# Altium schematic sheet 10 - Expansion Connectors.SchDoc
size B; CompanyName: Microchip Technology Inc.; Organization: Microchip Technology; Address1: 2355 West Chandler Blvd.; Address2: Chandler, AZ  85224; Address4: USA; SheetNumber: 11; SheetTotal: 15; SheetTitle: Expansion Connectors; Time: Time
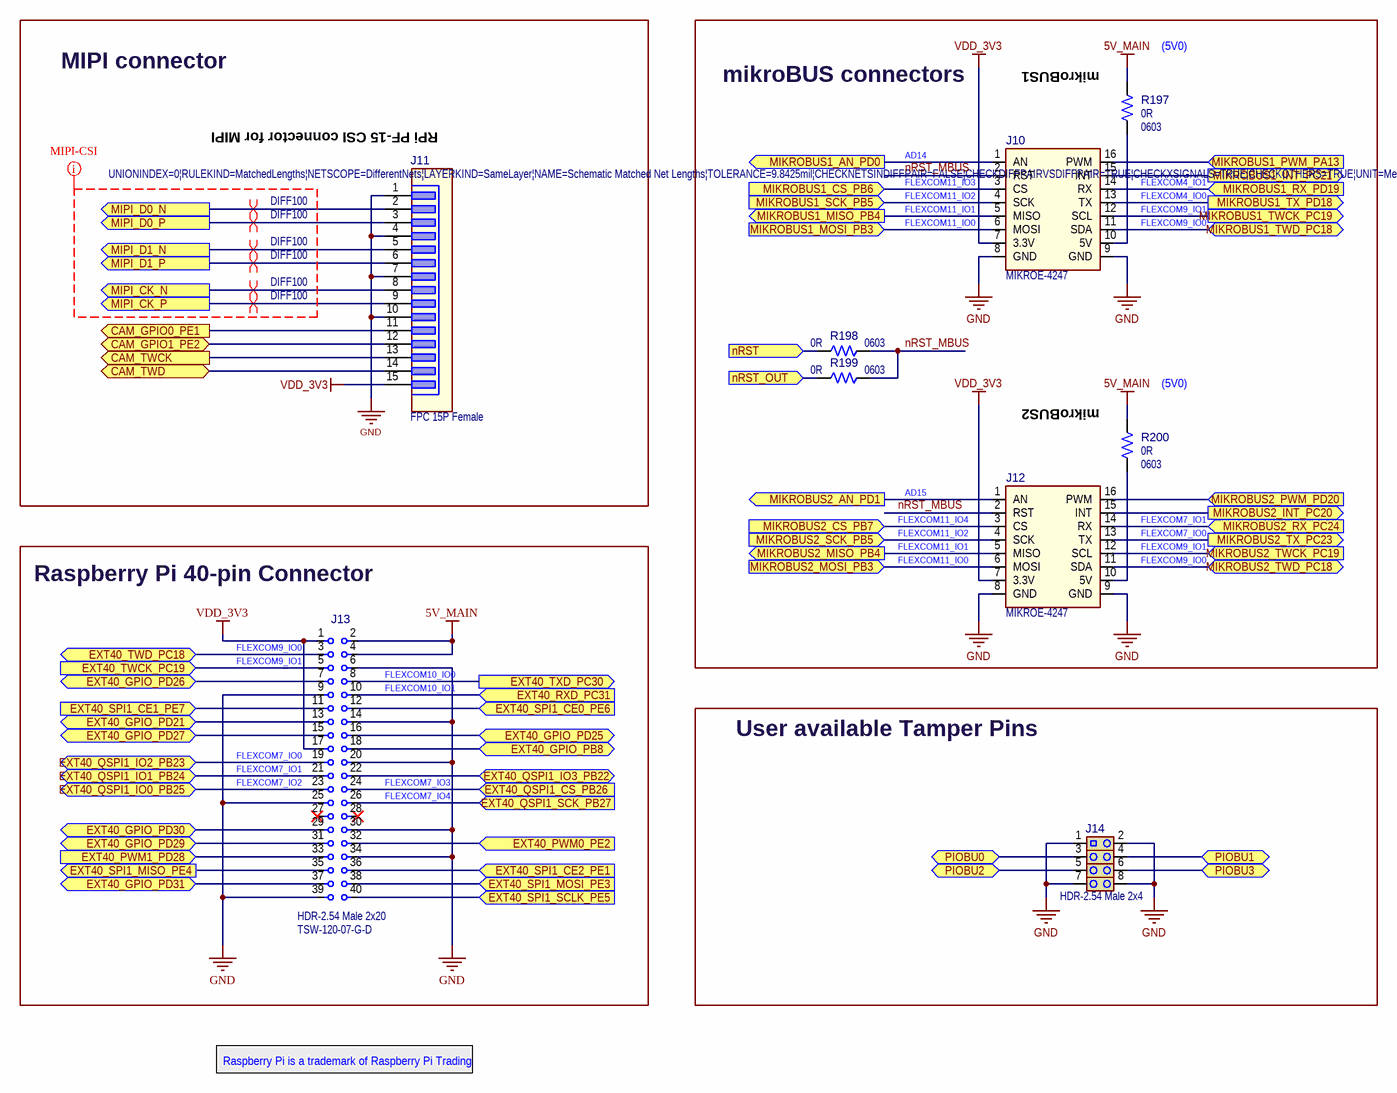
[diagram p0: 10 - Expansion Connectors.SchDoc]

## Parts
?  (no value)  (graphical)
J10  value MIKROE-4247  [SOCKET_mikroBUS_F_2.54_2x8_V_25.4x21_original]  (hidden comment: SOCKET mikroBUS HOST)
J11  value FPC 15P Female  [CON_FPC_1_FEMALE_1X15_SMD_TE_1-1734248-5]  (hidden comment: CON FPC 15pos)
J12  value MIKROE-4247  [SOCKET_mikroBUS_F_2.54_2x8_V_25.4x21_original]  (hidden comment: SOCKET mikroBUS HOST)
J13  value HDR-2.54 Male 2x20  Manufacturer Part Number 1: TSW-120-07-G-D  [HDR_M_2.54_2x20]  (hidden comment: Header 2x20)
J14  value HDR-2.54 Male 2x4  [HDR_M_2.54_2x4_SMD]  (hidden comment: Header 2x4)
R197  value 0R  Package: 0603  [RES_C_0603]  (hidden comment: Resistor)
R198  value 0R  Package: 0603  [RES_C_0603]  (hidden comment: Resistor)
R199  value 0R  Package: 0603  [RES_C_0603]  (hidden comment: Resistor)
R200  value 0R  Package: 0603  [RES_C_0603]  (hidden comment: Resistor)

## Blocks framed on the sheet
MIPI connector: J11
mikroBUS connectors: J10 J12 R197-R200
Raspberry Pi 40-pin Connector: J13
User available Tamper Pins: J14

## Ports
CAM_GPIO0_PE1 (out), CAM_GPIO1_PE2 (bidir), CAM_TWCK (out), CAM_TWD (bidir), EXT40_GPIO_PB8 (bidir), EXT40_GPIO_PD21 (bidir), EXT40_GPIO_PD25 (bidir), EXT40_GPIO_PD26 (bidir), EXT40_GPIO_PD27 (bidir), EXT40_GPIO_PD29 (bidir), EXT40_GPIO_PD30 (bidir), EXT40_GPIO_PD31 (bidir), EXT40_PWM0_PE2 (in), EXT40_PWM1_PD28 (in), EXT40_QSPI1_CS_PB26 (in), EXT40_QSPI1_IO0_PB25 (bidir), EXT40_QSPI1_IO1_PB24 (bidir), EXT40_QSPI1_IO2_PB23 (bidir), EXT40_QSPI1_IO3_PB22 (bidir), EXT40_QSPI1_SCK_PB27 (in), EXT40_RXD_PC31 (in), EXT40_SPI1_CE0_PE6 (in), EXT40_SPI1_CE1_PE7 (in), EXT40_SPI1_CE2_PE1 (in), EXT40_SPI1_MISO_PE4 (out), EXT40_SPI1_MOSI_PE3 (in), EXT40_SPI1_SCLK_PE5 (in), EXT40_TWCK_PC19 (in), EXT40_TWD_PC18 (bidir), EXT40_TXD_PC30 (out), MIKROBUS1_AN_PD0 (out), MIKROBUS1_CS_PB6 (in), MIKROBUS1_INT_PC21 (out), MIKROBUS1_MISO_PB4 (out), MIKROBUS1_MOSI_PB3 (in), MIKROBUS1_PWM_PA13 (in), MIKROBUS1_RX_PD19 (in), MIKROBUS1_SCK_PB5 (in), MIKROBUS1_TWCK_PC19 (out), MIKROBUS1_TWD_PC18 (bidir), MIKROBUS1_TX_PD18 (out), MIKROBUS2_AN_PD1 (out), MIKROBUS2_CS_PB7 (in), MIKROBUS2_INT_PC20 (out), MIKROBUS2_MISO_PB4 (out), MIKROBUS2_MOSI_PB3 (in), MIKROBUS2_PWM_PD20 (in), MIKROBUS2_RX_PC24 (in), MIKROBUS2_SCK_PB5 (in), MIKROBUS2_TWCK_PC19 (in), MIKROBUS2_TWD_PC18 (bidir), MIKROBUS2_TX_PC23 (out), MIPI_CK_N (out), MIPI_CK_P (out), MIPI_D0_N (out), MIPI_D0_P (out), MIPI_D1_N (out), MIPI_D1_P (out), nRST (in), nRST_OUT (in), PIOBU0 (bidir), PIOBU1 (bidir), PIOBU2 (bidir), PIOBU3 (bidir)

## Nets
5V_MAIN: J13.2 J13.4 R197.1 R200.1
GND: J10.8(GND) J10.9(GND) J11.1 J11.4 J11.7 J11.10 J12.8(GND) J12.9(GND) J13.6 J13.9 J13.14 J13.20 J13.25 J13.30 J13.34 J13.39 J14.1 J14.2 J14.7 J14.8
VDD_3V3: J10.7(3.3V) J11.15 J12.7(3.3V) J13.1 J13.17
CAM_GPIO0_PE1: J11.11 ; port CAM_GPIO0_PE1
CAM_GPIO1_PE2: J11.12 ; port CAM_GPIO1_PE2
CAM_TWCK: J11.13 ; port CAM_TWCK
CAM_TWD: J11.14 ; port CAM_TWD
EXT40_GPIO_PB8: J13.18 ; port EXT40_GPIO_PB8
EXT40_GPIO_PD21: J13.13 ; port EXT40_GPIO_PD21
EXT40_GPIO_PD25: J13.16 ; port EXT40_GPIO_PD25
EXT40_GPIO_PD26: J13.7 ; port EXT40_GPIO_PD26
EXT40_GPIO_PD27: J13.15 ; port EXT40_GPIO_PD27
EXT40_GPIO_PD29: J13.31 ; port EXT40_GPIO_PD29
EXT40_GPIO_PD30: J13.29 ; port EXT40_GPIO_PD30
EXT40_GPIO_PD31: J13.37 ; port EXT40_GPIO_PD31
EXT40_PWM0_PE2: J13.32 ; port EXT40_PWM0_PE2
EXT40_PWM1_PD28: J13.33 ; port EXT40_PWM1_PD28
EXT40_QSPI1_CS_PB26: J13.24 ; port EXT40_QSPI1_CS_PB26
EXT40_QSPI1_IO0_PB25: J13.23 ; port EXT40_QSPI1_IO0_PB25
EXT40_QSPI1_IO1_PB24: J13.21 ; port EXT40_QSPI1_IO1_PB24
EXT40_QSPI1_IO2_PB23: J13.19 ; port EXT40_QSPI1_IO2_PB23
EXT40_QSPI1_IO3_PB22: J13.22 ; port EXT40_QSPI1_IO3_PB22
EXT40_QSPI1_SCK_PB27: J13.26 ; port EXT40_QSPI1_SCK_PB27
EXT40_RXD_PC31: J13.10 ; port EXT40_RXD_PC31
EXT40_SPI1_CE0_PE6: J13.12 ; port EXT40_SPI1_CE0_PE6
EXT40_SPI1_CE1_PE7: J13.11 ; port EXT40_SPI1_CE1_PE7
EXT40_SPI1_CE2_PE1: J13.36 ; port EXT40_SPI1_CE2_PE1
EXT40_SPI1_MISO_PE4: J13.35 ; port EXT40_SPI1_MISO_PE4
EXT40_SPI1_MOSI_PE3: J13.38 ; port EXT40_SPI1_MOSI_PE3
EXT40_SPI1_SCLK_PE5: J13.40 ; port EXT40_SPI1_SCLK_PE5
EXT40_TWCK_PC19: J13.5 ; port EXT40_TWCK_PC19
EXT40_TWD_PC18: J13.3 ; port EXT40_TWD_PC18
EXT40_TXD_PC30: J13.8 ; port EXT40_TXD_PC30
MIKROBUS1_AN_PD0: J10.1(AN) ; port MIKROBUS1_AN_PD0
MIKROBUS1_CS_PB6: J10.3(CS) ; port MIKROBUS1_CS_PB6
MIKROBUS1_INT_PC21: J10.15(INT) ; port MIKROBUS1_INT_PC21
MIKROBUS1_MISO_PB4: J10.5(MISO) ; port MIKROBUS1_MISO_PB4
MIKROBUS1_MOSI_PB3: J10.6(MOSI) ; port MIKROBUS1_MOSI_PB3
MIKROBUS1_PWM_PA13: J10.16(PWM) ; port MIKROBUS1_PWM_PA13
MIKROBUS1_RX_PD19: J10.14(RX) ; port MIKROBUS1_RX_PD19
MIKROBUS1_SCK_PB5: J10.4(SCK) ; port MIKROBUS1_SCK_PB5
MIKROBUS1_TWCK_PC19: J10.12(SCL) ; port MIKROBUS1_TWCK_PC19
MIKROBUS1_TWD_PC18: J10.11(SDA) ; port MIKROBUS1_TWD_PC18
MIKROBUS1_TX_PD18: J10.13(TX) ; port MIKROBUS1_TX_PD18
MIKROBUS2_AN_PD1: J12.1(AN) ; port MIKROBUS2_AN_PD1
MIKROBUS2_CS_PB7: J12.3(CS) ; port MIKROBUS2_CS_PB7
MIKROBUS2_INT_PC20: J12.15(INT) ; port MIKROBUS2_INT_PC20
MIKROBUS2_MISO_PB4: J12.5(MISO) ; port MIKROBUS2_MISO_PB4
MIKROBUS2_MOSI_PB3: J12.6(MOSI) ; port MIKROBUS2_MOSI_PB3
MIKROBUS2_PWM_PD20: J12.16(PWM) ; port MIKROBUS2_PWM_PD20
MIKROBUS2_RX_PC24: J12.14(RX) ; port MIKROBUS2_RX_PC24
MIKROBUS2_SCK_PB5: J12.4(SCK) ; port MIKROBUS2_SCK_PB5
MIKROBUS2_TWCK_PC19: J12.12(SCL) ; port MIKROBUS2_TWCK_PC19
MIKROBUS2_TWD_PC18: J12.11(SDA) ; port MIKROBUS2_TWD_PC18
MIKROBUS2_TX_PC23: J12.13(TX) ; port MIKROBUS2_TX_PC23
MIPI_CK_N: J11.8 ; port MIPI_CK_N
MIPI_CK_P: J11.9 ; port MIPI_CK_P
MIPI_D0_N: J11.2 ; port MIPI_D0_N
MIPI_D0_P: J11.3 ; port MIPI_D0_P
MIPI_D1_N: J11.5 ; port MIPI_D1_N
MIPI_D1_P: J11.6 ; port MIPI_D1_P
nRST: R198.1 ; port nRST
nRST_MBUS: J10.2(RST) J12.2(RST) R198.2 R199.2
nRST_OUT: R199.1 ; port nRST_OUT
PIOBU0: J14.3 ; port PIOBU0
PIOBU1: J14.4 ; port PIOBU1
PIOBU2: J14.5 ; port PIOBU2
PIOBU3: J14.6 ; port PIOBU3
NetJ10_10: J10.10(5V) R197.2
NetJ12_10: J12.10(5V) R200.2

Not connected (* = marked no-connect by the designer): J13 27* 28*

## Layout directives
differential pair; differential pair class DIFF100; net class DIFF100; rule Matched Net Lengths [Tolerance = 4mil]: MIPI_CK_N, MIPI_CK_P, MIPI_D0_N, MIPI_D0_P, MIPI_D1_N, MIPI_D1_P
rule Matched Net Lengths [Tolerance = 0.25mm]; net class MIPI-CSI: (no net found under the mark)

## Notes on the sheet
- (near R197) mikroBUS1
- (near R197) (5V0)
- (near J11) RPi PF-15 CSI connector for MIPI
- AD14
- (near J10) FLEXCOM11_IO3
- (near J10) FLEXCOM11_IO2
- (near J10) FLEXCOM11_IO1
- (near J10) FLEXCOM11_IO0
- FLEXCOM4_IO1
- (near J10) FLEXCOM4_IO0
- (near J10) FLEXCOM9_IO1
- (near J10) FLEXCOM9_IO0
- (near R200) mikroBUS2
- (near R200) (5V0)
- AD15
- (near J12) FLEXCOM11_IO4
- (near J12) FLEXCOM11_IO2
- (near J12) FLEXCOM11_IO1
- (near J12) FLEXCOM11_IO0
- FLEXCOM7_IO1
- (near J12) FLEXCOM7_IO0
- (near J12) FLEXCOM9_IO1
- (near J12) FLEXCOM9_IO0
- (near J13) FLEXCOM9_IO1
- (near J13) FLEXCOM9_IO0
- (near J13) FLEXCOM10_IO0
- (near J13) FLEXCOM10_IO1
- (near J13) FLEXCOM7_IO0
- (near J13) FLEXCOM7_IO1
- (near J13) FLEXCOM7_IO2
- (near J13) FLEXCOM7_IO3
- (near J13) FLEXCOM7_IO4
- Raspberry Pi is a trademark of Raspberry Pi Trading
- Drawn By:
- Engineer:
- PartNumber:
- Project Title
- Sheet Title
- Size
- B
- SCH #:
- PCB #:
- Rev:
- Variant Name
- Date:
- Sheet
- Designed with
- Altium.com <http://go.altium.com/MicrochipLandingPage_Evaluation.html>
- File:

## Library data of the parts
? = Title Block B
J10 J12 = SKT1157: Manufacturer 1: MikroElektronika; Description_: SOCKET mikroBUS HOST DIP 16 TH; Dev Tools Status: Design; Owner: Dragos Danaila; Populated: YES; MCHP-ID: SKT1157; Revision: 2; Symbol: SOCKET mikroBUS HOST; Status: MCL Design; ComponentLink1URL: https://chn-vm-apps.microchip.com/mchprepo/parts/Datasheets/MIKROE-4247.pdf; ComponentLink1Description: SVN Datasheet; ComponentLink2URL: C:\ALTIUM_WORK\00001_MCHP-CDB\Datasheets\MIKROE-4247.pdf; ComponentLink2Description: Local Datasheet; ComponentLink3URL: C:\ALTIUM_WORK\00001_MCHP-CDB\Library\LibraryRefs\SOCKET mikroBUS HOST.SchLib; ComponentLink3Description: Open Symbol; ComponentLink4URL: C:\ALTIUM_WORK\00001_MCHP-CDB\Library\Footprints\SOCKET_mikroBUS_F_2.54_2x8_V_25.4x21_original.PcbLib; ComponentLink4Description: Open Footprint; ComponentLink5Description: Open Footprint 2; ComponentLink6Description: Open Footprint 3; ComponentLink7Description: Open Footprint 4; Type: MikroBUS; Category: Socket; Manufacturer Part Number 1: MIKROE-4247; Manufacturer 2: MikroElektronika; Manufacturer Part Number 2: MIKROE-4247; Supplier 1: TME; Supplier Part Number 1: MIKROE-4247; Supplier 2: TME; Supplier Part Number 2: MIKROE-4247; Quantity Override: 1
J11 = CON1911: Manufacturer 1: TE Connectivity AMP Connectors; Manufacturer Part Number 1: 1-1734248-5; Description_: CON FPC 1mm 15P Female SMD VERT; Dev Tools Status: Design; Owner: Ilie Galan; Voltage: 125V; Populated: YES; MCHP-ID: CON1911; Revision: 1; Symbol: CON FPC 15pos; Status: MCL Design; ComponentLink1URL: https://chn-vm-apps.microchip.com/mchprepo/parts/Datasheets/ENG_CD_1734248_E1__.pdf; ComponentLink1Description: SVN Datasheet; ComponentLink2URL: C:\ALTIUM_WORK\00001_MCHP-CDB\Datasheets\ENG_CD_1734248_E1__.pdf; ComponentLink2Description: Local Datasheet; ComponentLink3URL: C:\ALTIUM_WORK\00001_MCHP-CDB\Library\LibraryRefs\CON FPC 15pos.SchLib; ComponentLink3Description: Open Symbol; ComponentLink4URL: C:\ALTIUM_WORK\00001_MCHP-CDB\Library\Footprints\CON_FPC_1_FEMALE_1X15_SMD_TE_1-1734248-5.PcbLib; ComponentLink4Description: Open Footprint; ComponentLink5Description: Open Footprint 2; ComponentLink6Description: Open Footprint 3; ComponentLink7Description: Open Footprint 4; Type: FFC/FPC; Category: Connector; Supplier 1: Digi-Key; Supplier Part Number 1: A101418CT-ND; Quantity Override: 1
J13 = CON0153: Manufacturer 1: Samtec; Description_: CON HDR-2.54 Male 2x20 Gold 5.84MH TH VERT; Dev Tools Status: Production; Owner: Stephen Humberd; Populated: YES; MCHP-ID: CON0153; Revision: 1; Symbol: Header 2x20; Status: MCL Design; ComponentLink1URL: https://chn-vm-apps.microchip.com/mchprepo/parts/Datasheets/TSW-XXX-XX-XXX-X-XX-XXX-MKT.pdf; ComponentLink1Description: SVN Datasheet; ComponentLink2URL: C:\ALTIUM_WORK\00001_MCHP-CDB\Datasheets\TSW-XXX-XX-XXX-X-XX-XXX-MKT.pdf; ComponentLink2Description: Local Datasheet; ComponentLink3URL: C:\ALTIUM_WORK\00001_MCHP-CDB\Library\LibraryRefs\Header 2x20.SchLib; ComponentLink3Description: Open Symbol; ComponentLink4URL: C:\ALTIUM_WORK\00001_MCHP-CDB\Library\Footprints\HDR_M_2.54_2x20.PcbLib; ComponentLink4Description: Open Footprint; ComponentLink5Description: Open Footprint 2; ComponentLink6Description: Open Footprint 3; ComponentLink7Description: Open Footprint 4; Type: Header 2.54mm; Category: Connector; Manufacturer 2: Samtec; Manufacturer Part Number 2: TSW-120-07-S-D; Supplier 1: Samtec; Supplier Part Number 1: TSW-120-07-G-D; Supplier 2: Samtec; Supplier Part Number 2: TSW-120-07-S-D; Quantity Override: 1
J14 = CON1426: Manufacturer 1: Sullins Connector Solutions; Manufacturer Part Number 1: GBC04DABN-M30; Description_: CON HDR-2.54 Male 2x4 Gold 5.84MH SMT VERT; Dev Tools Status: Design; Owner: Jamus Griego; Populated: DNP; MCHP-ID: CON1426; Revision: B; Symbol: Header 2x4; Status: MCL Design; ComponentLink1URL: https://chn-vm-apps.microchip.com/mchprepo/parts/Datasheets/C10059.pdf; ComponentLink1Description: SVN Datasheet; ComponentLink2URL: C:\ALTIUM_WORK\00001_MCHP-CDB\Datasheets\C10059.pdf; ComponentLink2Description: Local Datasheet; ComponentLink3URL: C:\ALTIUM_WORK\00001_MCHP-CDB\Library\LibraryRefs\Header 2x4.SchLib; ComponentLink3Description: Open Symbol; ComponentLink4URL: C:\ALTIUM_WORK\00001_MCHP-CDB\Library\Footprints\HDR_M_2.54_2x4_SMD.PcbLib; ComponentLink4Description: Open Footprint; ComponentLink5Description: Open Footprint 2; ComponentLink6Description: Open Footprint 3; ComponentLink7Description: Open Footprint 4; Type: Header 2.54mm; Category: Connector; Supplier 1: Digi-Key; Supplier Part Number 1: S2351E-04-ND; Quantity Override: 1
R197 R199 R200 = RSMT0001: Manufacturer 1: Panasonic; Manufacturer Part Number 1: ERJ-3GSY0R00V; Description_: RES TKF 0R 1/10W SMD 0603; Dev Tools Status: Production; Power: 1/10W; Populated: YES; MCHP-ID: RSMT0001; Revision: 2; Symbol: Resistor; Status: MCL Design; ComponentLink1URL: https://chn-vm-apps.microchip.com/mchprepo/parts/Datasheets/nrc.pdf; ComponentLink1Description: SVN Datasheet; ComponentLink2URL: C:\ALTIUM_WORK\00001_MCHP-CDB\Datasheets\nrc.pdf; ComponentLink2Description: Local Datasheet; ComponentLink3URL: C:\ALTIUM_WORK\00001_MCHP-CDB\Library\LibraryRefs\Resistor.SchLib; ComponentLink3Description: Open Symbol; ComponentLink4URL: C:\ALTIUM_WORK\00001_MCHP-CDB\Library\Footprints\RES_C_0603.PcbLib; ComponentLink4Description: Open Footprint; ComponentLink5Description: Open Footprint 2; ComponentLink6Description: Open Footprint 3; ComponentLink7Description: Open Footprint 4; Operating Temperature: -55C to +155C; Category: Resistor; Type: RES SMD; Composition: TKF; Manufacturer 2: Panasonic; Manufacturer Part Number 2: ERJ-3GEY0R00V; Manufacturer 3: ROHM; Manufacturer Part Number 3: MCR03EZPJ000; Manufacturer 4: Stackpole Electronics Inc; Manufacturer Part Number 4: RMCF0603ZT0R00; Manufacturer 5: Stackpole Electronics Inc; Manufacturer Part Number 5: RMCF 1/16 0 R; Manufacturer 6: Vishay; Manufacturer Part Number 6: CRCW06030000Z0EA; Manufacturer 7: Yageo; Manufacturer Part Number 7: RC0603JR-070RL; Manufacturer 8: KOA Speer; Manufacturer Part Number 8: RK73Z1JTTP; Manufacturer 9: NIC Components; Manufacturer Part Number 9: NRC06Z0TRF; Supplier 1: Digi-Key; Supplier Part Number 1: P0.0GTR-ND; Supplier 2: Digi-Key; Supplier Part Number 2: RHM0.0GCT-ND; Supplier 3: Digi-Key; Supplier Part Number 3: RMCF0603ZT0R00TR-ND; Supplier 4: Digi-Key; Supplier Part Number 4: RMCF0603ZT0R00CT-ND; Supplier 5: Digi-Key; Supplier Part Number 5: RMCF1/160RTR-ND; Supplier 6: Digi-Key; Supplier Part Number 6: 541-0.0GCT-ND; Supplier 7: Digi-Key; Supplier Part Number 7: 311-0.0GRCT-ND; Supplier 8: KOA Speer; Supplier Part Number 8: RK73Z1JTTP; Supplier 9: NIC Components; Supplier Part Number 9: NRC06Z0TRF; Quantity Override: 1
R198 = RSMT0001: Manufacturer 1: Panasonic; Manufacturer Part Number 1: ERJ-3GSY0R00V; Description_: RES TKF 0R 1/10W SMD 0603; Dev Tools Status: Production; Power: 1/10W; Populated: DNP; MCHP-ID: RSMT0001; Revision: 2; Symbol: Resistor; Status: MCL Design; ComponentLink1URL: https://chn-vm-apps.microchip.com/mchprepo/parts/Datasheets/nrc.pdf; ComponentLink1Description: SVN Datasheet; ComponentLink2URL: C:\ALTIUM_WORK\00001_MCHP-CDB\Datasheets\nrc.pdf; ComponentLink2Description: Local Datasheet; ComponentLink3URL: C:\ALTIUM_WORK\00001_MCHP-CDB\Library\LibraryRefs\Resistor.SchLib; ComponentLink3Description: Open Symbol; ComponentLink4URL: C:\ALTIUM_WORK\00001_MCHP-CDB\Library\Footprints\RES_C_0603.PcbLib; ComponentLink4Description: Open Footprint; ComponentLink5Description: Open Footprint 2; ComponentLink6Description: Open Footprint 3; ComponentLink7Description: Open Footprint 4; Operating Temperature: -55C to +155C; Category: Resistor; Type: RES SMD; Composition: TKF; Manufacturer 2: Panasonic; Manufacturer Part Number 2: ERJ-3GEY0R00V; Manufacturer 3: ROHM; Manufacturer Part Number 3: MCR03EZPJ000; Manufacturer 4: Stackpole Electronics Inc; Manufacturer Part Number 4: RMCF0603ZT0R00; Manufacturer 5: Stackpole Electronics Inc; Manufacturer Part Number 5: RMCF 1/16 0 R; Manufacturer 6: Vishay; Manufacturer Part Number 6: CRCW06030000Z0EA; Manufacturer 7: Yageo; Manufacturer Part Number 7: RC0603JR-070RL; Manufacturer 8: KOA Speer; Manufacturer Part Number 8: RK73Z1JTTP; Manufacturer 9: NIC Components; Manufacturer Part Number 9: NRC06Z0TRF; Supplier 1: Digi-Key; Supplier Part Number 1: P0.0GTR-ND; Supplier 2: Digi-Key; Supplier Part Number 2: RHM0.0GCT-ND; Supplier 3: Digi-Key; Supplier Part Number 3: RMCF0603ZT0R00TR-ND; Supplier 4: Digi-Key; Supplier Part Number 4: RMCF0603ZT0R00CT-ND; Supplier 5: Digi-Key; Supplier Part Number 5: RMCF1/160RTR-ND; Supplier 6: Digi-Key; Supplier Part Number 6: 541-0.0GCT-ND; Supplier 7: Digi-Key; Supplier Part Number 7: 311-0.0GRCT-ND; Supplier 8: KOA Speer; Supplier Part Number 8: RK73Z1JTTP; Supplier 9: NIC Components; Supplier Part Number 9: NRC06Z0TRF; Quantity Override: 1